# Altium schematic sheet 400_POWER_STAGE.SchDoc
size A2; SheetNumber: 4; SheetTotal: 5
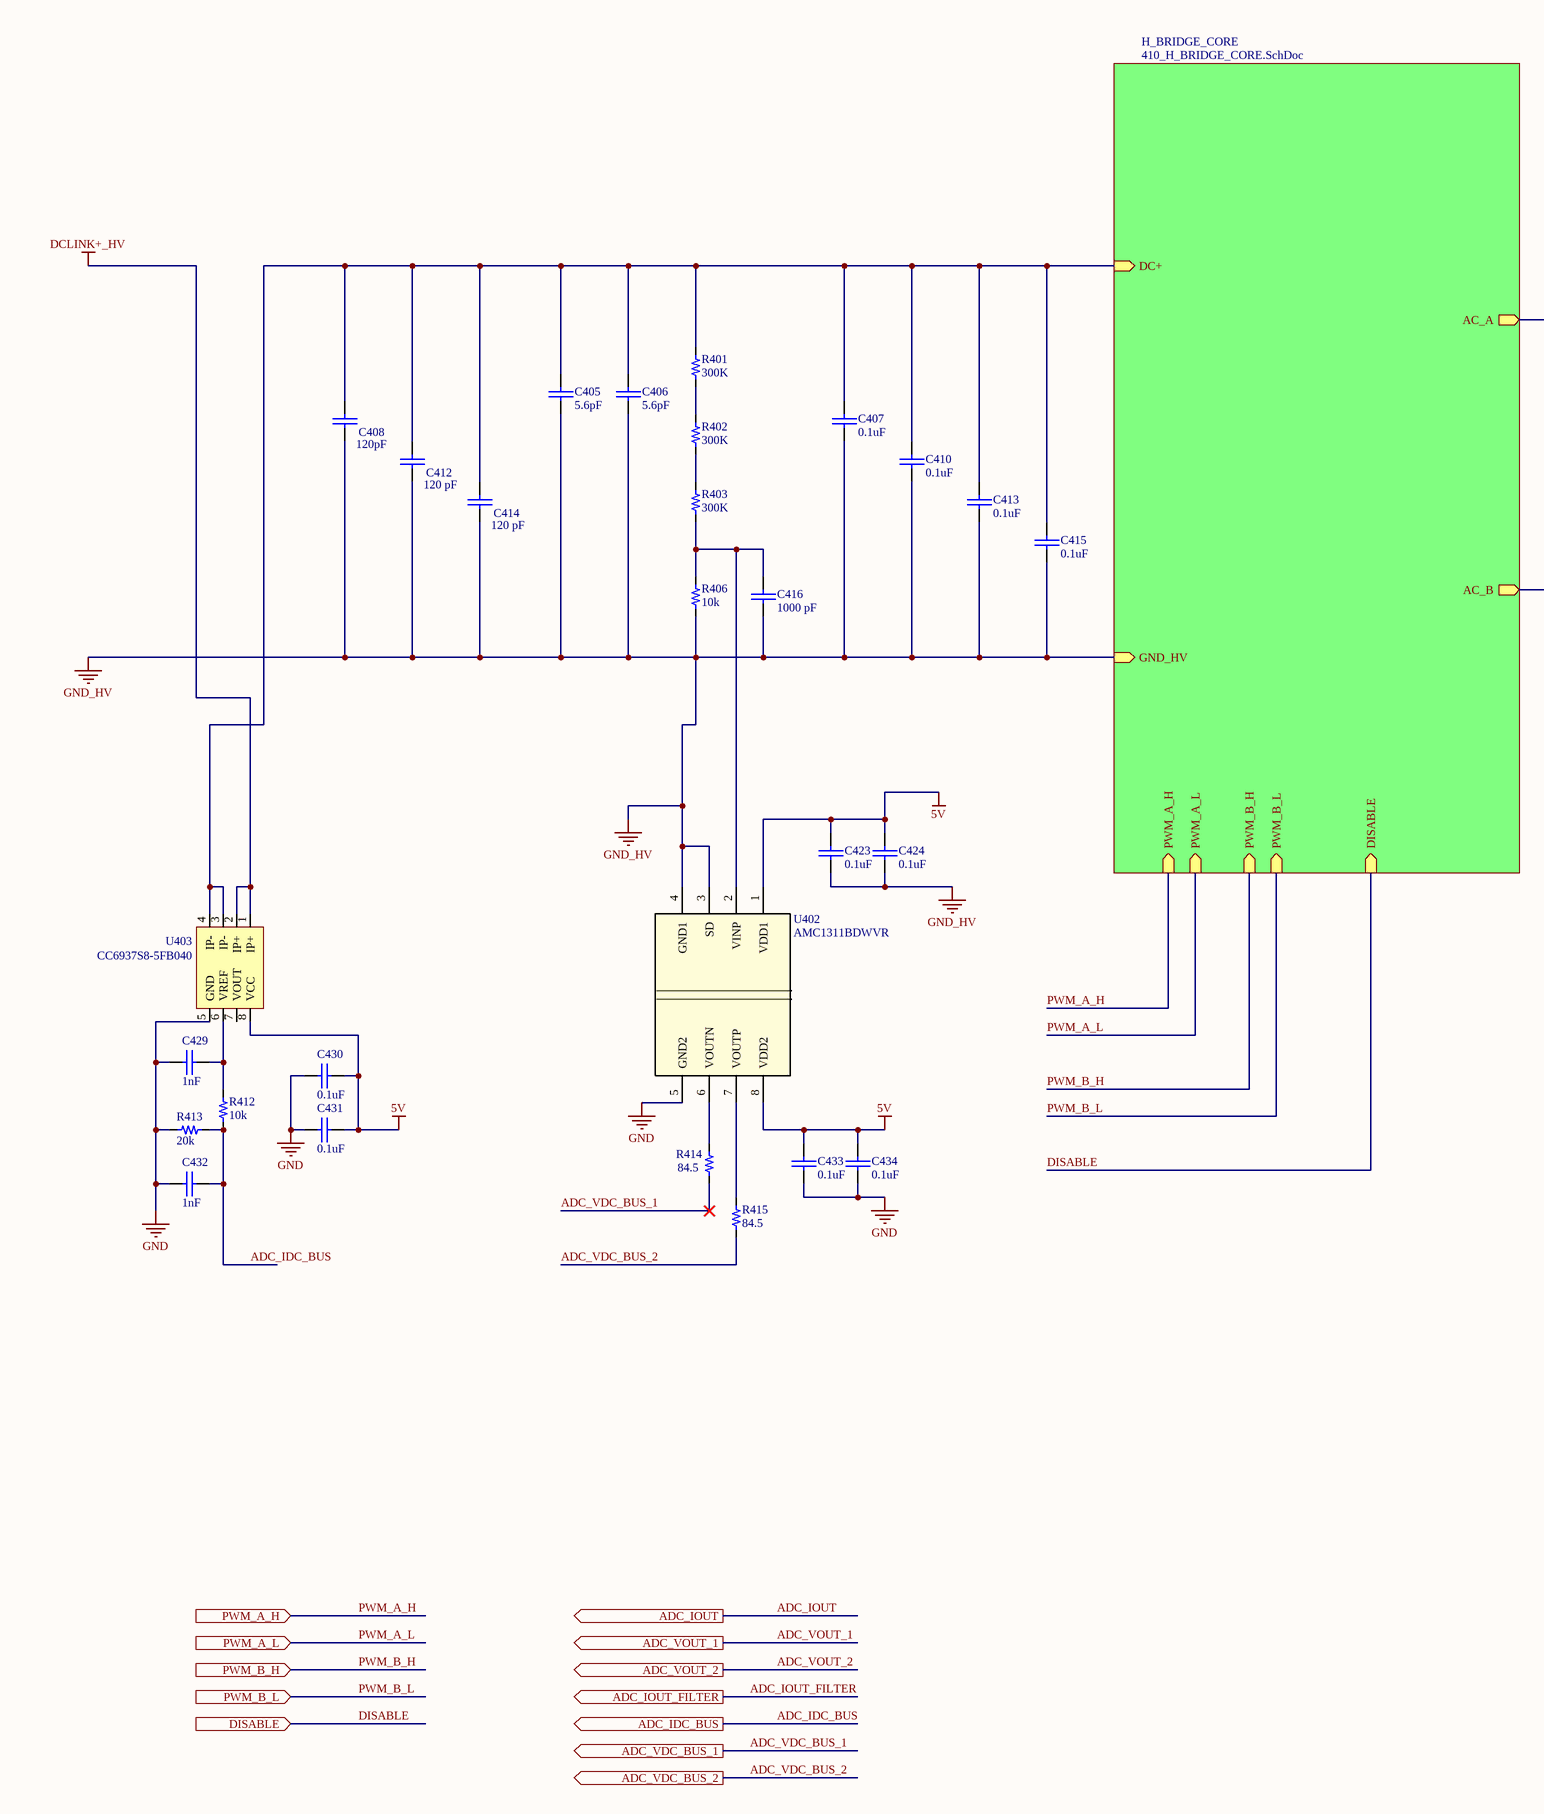
[diagram p0: 400_POWER_STAGE.SchDoc, left]
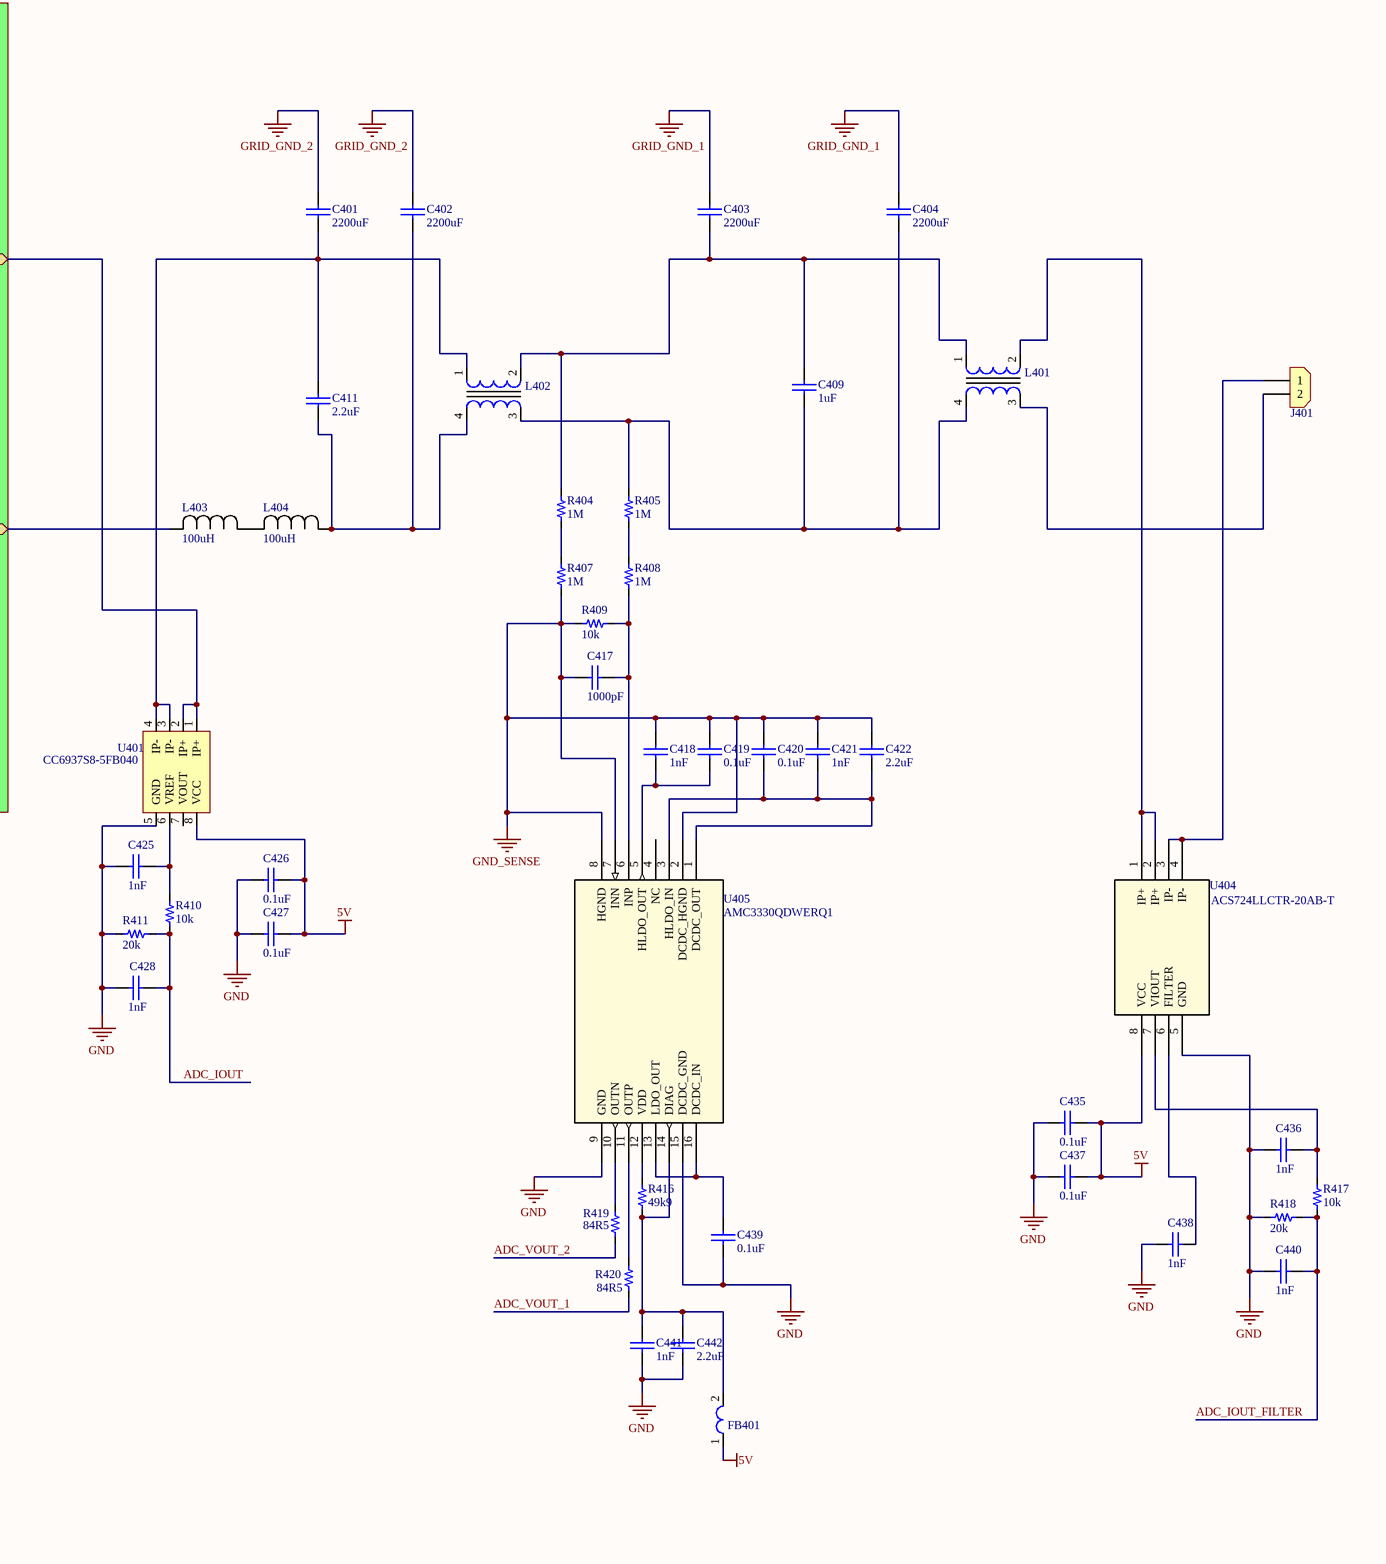
[diagram p1: 400_POWER_STAGE.SchDoc, right]

## Parts
C401  2200uF  [Through Hole,P=7.5mm]
C402  2200uF  [Through Hole,P=7.5mm]
C403  2200uF  [Through Hole,P=7.5mm]
C404  2200uF  [Through Hole,P=7.5mm]
C405  value 5.6pF  [0603_cap]  (hidden comment: 2.2uF)
C406  value 5.6pF  [0603_cap]  (hidden comment: 2.2uF)
C407  0.1uF  [0603_cap]
C408  120pF  [0603_cap]
C409  value 1uF  [CAP_2220]  (hidden comment: 1uF 50V)
C410  0.1uF  [0603_cap]
C411  value 2.2uF  [CAP_2220]
C412  120 pF  [0603_cap]
C413  0.1uF  [0603_cap]
C414  120 pF  [0603_cap]
C415  0.1uF  [0603_cap]
C416  1000 pF  [0603_cap]
C417  value 1000pF  [0603_cap]
C418  value 1nF  [0603_cap]
C419  0.1uF  [0603_cap]
C420  0.1uF  [0603_cap]
C421  value 1nF  [0603_cap]
C422  value 2.2uF  [0603_cap]
C423  0.1uF  [0603_cap]
C424  0.1uF  [0603_cap]
C425  value 1nF  [0603_cap]
C426  0.1uF  [0603_cap]
C427  0.1uF  [0603_cap]
C428  value 1nF  [0603_cap]
C429  value 1nF  [0603_cap]
C430  0.1uF  [0603_cap]
C431  0.1uF  [0603_cap]
C432  value 1nF  [0603_cap]
C433  0.1uF  [0603_cap]
C434  0.1uF  [0603_cap]
C435  0.1uF  [0603_cap]
C436  value 1nF  [0603_cap]
C437  0.1uF  [0603_cap]
C438  value 1nF  [0603_cap]
C439  0.1uF  [0603_cap]
C440  value 1nF  [0603_cap]
C441  value 1nF  [0603_cap]
C442  value 2.2uF  [0603_cap]
FB401  (no value)  [MH1608]
J401  (no value)  [CON_2x1_TH_5MM]
L401  (no value)  [PH9455405NL]
L402  (no value)  [PH9455405NL]
L403  value 100uH  [IND-SMD_L13.7-W12.8_FCH1365]  (hidden comment: 200uH)
L404  value 100uH  [IND-SMD_L13.7-W12.8_FCH1365]  (hidden comment: 200uH)
R401  300K  [0603_res]
R402  300K  [0603_res]
R403  300K  [0603_res]
R404  value 1M  [0603_res]
R405  value 1M  [0603_res]
R406  value 10k  [0603_res]
R407  value 1M  [0603_res]
R408  value 1M  [0603_res]
R409  value 10k  [0603_res]
R410  value 10k  [0603_res]
R411  20k  [0603_res]
R412  value 10k  [0603_res]
R413  20k  [0603_res]
R414  value 84.5  [0603_res]
R415  value 84.5  [0603_res]
R416  value 49k9  [0603_res]
R417  value 10k  [0603_res]
R418  20k  [0603_res]
R419  value 84R5  [0603_res]
R420  value 84R5  [0603_res]
U401  Manufacturer Part Number: CC6937S8-5FB040  [SOP-8_L4.9]
U402  AMC1311BDWVR  [DWV0008A]
U403  Manufacturer Part Number: CC6937S8-5FB040  [SOP-8_L4.9]
U404  Manufacturer Part Number: ACS724LLCTR-20AB-T  [SOICN8_LC_ALM]
U405  AMC3330QDWERQ1  [SOIC16_DWE_TEX]

## Sub-sheets
H_BRIDGE_CORE = 410_H_BRIDGE_CORE.SchDoc: PWM_A_H (in), PWM_A_L (in), PWM_B_H (in), PWM_B_L (in), DC+ (in), GND_HV (in), DISABLE (in), AC_A (out), AC_B (out)

## Ports
ADC_IDC_BUS (out), ADC_IOUT (out), ADC_IOUT_FILTER (out), ADC_VDC_BUS_1 (out), ADC_VDC_BUS_2 (out), ADC_VOUT_1 (out), ADC_VOUT_2 (out), DISABLE (in), PWM_A_H (in), PWM_A_L (in), PWM_B_H (in), PWM_B_L (in)

## Nets
5V: C423.1 C424.1 C426.2 C427.2 C430.2 C431.2 C433.1 C434.1 C435.2 C437.2 FB401.1 U401.8(VCC) U402.1(VDD1) U402.8(VDD2) U403.8(VCC) U404.8(VCC)
DCLINK+_HV: U403.1(IP+) U403.2(IP+)
GND: C425.2 C426.1 C427.1 C428.1 C429.2 C430.1 C431.1 C432.1 C433.2 C434.2 C435.1 C436.2 C437.1 C438.2 C439.2 C440.1 C441.2 C442.2 R411.1 R413.1 R418.1 U401.5(GND) U402.5(GND2) U403.5(GND) U404.5(GND) U405.9(GND) U405.15(DCDC_GND)
GND_HV: C405.2 C406.2 C407.2 C408.2 C410.2 C412.2 C413.2 C414.2 C415.2 C416.2 C423.2 C424.2 R406.1 U402.3(SD) U402.4(GND1) ; sheet H_BRIDGE_CORE/GND_HV
GND_SENSE: C417.1 C418.1 C419.1 C420.1 C421.1 C422.1 R407.1 R409.1 U405.2(DCDC_HGND) U405.7(INN) U405.8(HGND)
GRID_GND_1: C403.1 C404.1
GRID_GND_2: C401.1 C402.1
ADC_IDC_BUS: C432.2 R412.1 R413.2 ; port ADC_IDC_BUS
ADC_IOUT: C428.2 R410.1 R411.2 ; port ADC_IOUT
ADC_IOUT_FILTER: C440.2 R417.1 R418.2 ; port ADC_IOUT_FILTER
ADC_VDC_BUS_1: R414.1 ; port ADC_VDC_BUS_1
ADC_VDC_BUS_2: R415.1 ; port ADC_VDC_BUS_2
ADC_VOUT_1: R420.1 ; port ADC_VOUT_1
ADC_VOUT_2: R419.1 ; port ADC_VOUT_2
DISABLE: port DISABLE, sheet H_BRIDGE_CORE/DISABLE
PWM_A_H: port PWM_A_H, sheet H_BRIDGE_CORE/PWM_A_H
PWM_A_L: port PWM_A_L, sheet H_BRIDGE_CORE/PWM_A_L
PWM_B_H: port PWM_B_H, sheet H_BRIDGE_CORE/PWM_B_H
PWM_B_L: port PWM_B_L, sheet H_BRIDGE_CORE/PWM_B_L
NetC401_2: C401.2 C411.2 L402.1 U401.3(IP-) U401.4(IP-)
NetC402_2: C402.2 C411.1 L402.4 L404.1
NetC403_2: C403.2 C409.1 L401.1 L402.2 R404.2
NetC404_2: C404.2 C409.2 L401.4 L402.3 R405.2
NetC405_1: C405.1 C406.1 C407.1 C408.1 C410.1 C412.1 C413.1 C414.1 C415.1 R401.2 U403.3(IP-) U403.4(IP-) ; sheet H_BRIDGE_CORE/DC+
NetC416_1: C416.1 R403.1 R406.2 U402.2(VINP)
NetC417_2: C417.2 R408.1 R409.2 U405.6(INP)
NetC418_2: C418.2 C419.2 U405.5(HLDO_OUT)
NetC420_2: C420.2 C421.2 C422.2 U405.1(DCDC_OUT) U405.3(HLDO_IN)
NetC425_1: C425.1 R410.2 U401.6(VREF)
NetC429_1: C429.1 R412.2 U403.6(VREF)
NetC436_1: C436.1 R417.2 U404.7(VIOUT)
NetC438_1: C438.1 U404.6(FILTER)
NetC439_1: C439.1 U405.13(LDO_OUT) U405.16(DCDC_IN)
NetC441_1: C441.1 C442.1 FB401.2 R416.2 U405.14(DIAG)
NetJ401_1: J401.1 U404.3(IP-) U404.4(IP-)
NetJ401_2: J401.2 L401.3
NetL401_2: L401.2 U404.1(IP+) U404.2(IP+)
NetL403_1: L403.1 L404.2
NetL403_2: L403.2 ; sheet H_BRIDGE_CORE/AC_B
NetR401_1: R401.1 R402.2
NetR402_1: R402.1 R403.2
NetR404_1: R404.1 R407.2
NetR405_1: R405.1 R408.2
NetR414_2: R414.2 U402.6(VOUTN)
NetR415_2: R415.2 U402.7(VOUTP)
NetR416_1: R416.1 U405.12(VDD)
NetR419_2: R419.2 U405.10(OUTN)
NetR420_2: R420.2 U405.11(OUTP)
NetU401_1: U401.1(IP+) U401.2(IP+) ; sheet H_BRIDGE_CORE/AC_A

Not connected (* = marked no-connect by the designer): U401 7(VOUT); U403 7(VOUT); U405 4(NC)

## Library data of the parts
C401-C404 = CAP_CER_2200PF_300VAC: 2200 pF ±20% 300VAC Ceramic Capacitor E Radial, Disc; Manufacturer: Murata Electronics; Manufacturer Part Number: DE6E3KJ222MN3A; Supplier 1: LCSC; Supplier Part Number 1: C710554; ComponentLink1Description: LCSC; ComponentLink1URL: https://www.lcsc.com/product-detail/C710554.html?s_z=n_q_DE6E3KJ222MN3A&spm=wm.fly.bg.0.xh&lcsc_vid=FQVeX1BfQFIKVFVWE1NbBlcHQlcKVgFUQwMPAQZWElcxVlNRTlheV1JTQ1JYVzsOAxUeFF5JWBYZEEoKFBINSQcJGk4eFQsCAgIaSgADAwAHC0slRVBYUFVUTk8GEwkK; Value: 2200uF
C405 C406 = CAP_CER_5.6pF_C0G_250V_0603: 5.6pF C0G 250V 0603 Ceramic Capacitors RoHS; Manufacturer: Taiyo Yuden; Manufacturer Part Number: VJ0603D5R6CXPAJ; Supplier 1: LCSC; Supplier Part Number 1: C2241545; ComponentLink1Description: LCSC; ComponentLink1URL: https://www.lcsc.com/product-detail/C337443.html?s_z=n_q_EMK107BB7225KA-T&spm=wm.fly.bg.0.xh&lcsc_vid=FQVeX1BfQFIKVFVWE1NbBlcHQlcKVgFUQwMPAQZWElcxVlNRTlheVFNUQFFcXzsOAxUeFF5JWBYZEEoKFBINSQcJGk4eFQsCAgIaSgADAwAHC0slRldcVVFRWQkaCgg%3D
C407 C410 C413 C415 C419 C420 C423 C424 C426 C427 C430 C431 C433-C435 C437 C439 = Cap_0.1uF_0603_50V: CAP CER 100nF 50V Y5V 0603; Manufacturer: FOJAN; Manufacturer Part Number: FCC0603F104Z500CT; Supplier 1: LCSC; Supplier Part Number 1: C5137469; ComponentLink1Description: LCSC; ComponentLink1URL: https://www.lcsc.com/product-detail/C5137469.html?s_z=n_q_0603F104Z500CT&spm=wm.fly.bg.2.xh&lcsc_vid=Q1QLUFRRTgRfUVdSQAVWUgVQT1JdUlwFE1MMV1EEQgAxVlNRTlhfUFBXRlRXUTsOAxUeFF5JWBYZEEoKFBINSQcJGk4eFQsCAgIaSgADAwAHC0slTldfUldfWQkaCgg%3D; Value: 0.1uF
C408 C412 C414 = CAP_CER _120PF_250V_0603: 120 pF ±5% 250V Capacitores cerámicos C0G, NP0 0603 (1608 métrico); Manufacturer: YAGEO; Manufacturer Part Number: CL10B102KB8NNNC; Supplier 1: LCSC; Supplier Part Number 1: C3852667; ComponentLink1Description: LCSC; ComponentLink1URL: https://www.lcsc.com/product-detail/C3852667.html?s_z=n_q_CC0603JRNPOYBN121&spm=wm.fly.bg.0.xh&lcsc_vid=Q1QLUFRRTgRfUVdSQAVWUgVQT1JdUlwFE1MMV1EEQgAxVlNRTldaUVdSRlBeXjsOAxUeFF5JWBYZEEoKFBINSQcJGk4dAgUUFAk%3D
C409 = CAP CER 1uF 450V X7T 2220: Manufacturer: muRata; Manufacturer Part Number: GC355XD7LP105KX17L; Supplier 1: LCSC; Supplier Part Number 1: C5119323; ComponentLink1Description: LCSC; ComponentLink1URL: https://www.lcsc.com/product-detail/C5119323.html?s_z=n_q_t_ceramic%2520capacitor&spm=wm.fly.bg.0.xh___wm.ssy.tc.0.tz&lcsc_vid=Q1QLUFRRTgRfUVdSQAVWUgVQT1JdUlwFE1MMV1EEQgAxVlNRTlhcUlRSQVJdUzsOAxUeFF5JWBYZEEoKFBINSQcJGk4dAgUUFAk%3D
C411 = Cap_2.2uF_2220: CAP CER 2.2uF 250V X7R 2220; Manufacturer: CCTC; Manufacturer Part Number: 2220B225K251CT; Supplier 1: LCSC; Supplier Part Number 1: C3845592; ComponentLink1Description: LCSC; ComponentLink1URL: https://www.lcsc.com/product-detail/Multilayer-Ceramic-Capacitors-MLCC-SMD-SMT_CCTC-TCC0603X5R106K100CT_C380314.html
C416 = CAP_CER_1000PF_10V_X7R_0603: 1000 pF ±10% 10V Ceramic Capacitor X7R 0603 (1608 Metric); Manufacturer: Johanson Technology Inc.; Manufacturer Part Number: C0603C102K5RACTU; Supplier 1: LCSC; Supplier Part Number 1: C2167129; ComponentLink1Description: LCSC; ComponentLink1URL: https://www.lcsc.com/product-detail/C2167129.html?s_z=n_q_p_C0603C102K8RACTU&spm=wm.ssy.bg.0.xh&lcsc_vid=FQVeX1BfQFIKVFVWE1NbBlcHQlcKVgFUQwMPAQZWElcxVlNRTllaV1NURlFaVzsOAxUeFF5JWBYZEEoKFBINSQcJGk4eFQsCAgIaSgADAwAHC0slRlBaUVJRWQkaCgg%3D
C417 = CAP CER 1000pF 100V C0G 0603: CAP CER 1nF 100V C0G 0603; Manufacturer: muRata; Manufacturer Part Number: GRM1885C2A102JA01D; Supplier 1: LCSC; Supplier Part Number 1: C162257; ComponentLink1Description: LCSC; ComponentLink1URL: https://www.lcsc.com/product-detail/C162257.html?s_z=n_q_GRM1885C2A102JA01D&spm=wm.fly.bg.0.xh&lcsc_vid=FQVeX1BfQFIKVFVWE1NbBlcHQlcKVgFUQwMPAQZWElcxVlNRTlheVFZSTlJfXjsOAxUeFF5JWBYZEEoKFBINSQcJGk4%3D
C418 C421 C425 C428 C429 C432 C436 C438 C440 C441 = Cap_1nF_0603_50V: 50V 1nF X7R ±10% 0603 Multilayer Ceramic Capacitors MLCC - SMD/SMT ROHS; Manufacturer: YAGEO; Manufacturer Part Number: CC0603KRX7R9BB102; Supplier 1: LCSC; Supplier Part Number 1: C100040; ComponentLink1Description: LCSC; ComponentLink1URL: https://www.lcsc.com/product-detail/Multilayer-Ceramic-Capacitors-MLCC-SMD-SMT_YAGEO-CC0603KRX7R9BB102_C100040.html
C422 C442 = CAP CER 2.2uF 16V X7R 0603: Manufacturer: Taiyo Yuden; Manufacturer Part Number: EMK107BB7225KA-T; Supplier 1: LCSC; Supplier Part Number 1: C337443; ComponentLink1Description: LCSC; ComponentLink1URL: https://www.lcsc.com/product-detail/C337443.html?s_z=n_q_EMK107BB7225KA-T&spm=wm.fly.bg.0.xh&lcsc_vid=FQVeX1BfQFIKVFVWE1NbBlcHQlcKVgFUQwMPAQZWElcxVlNRTlheVFNUQFFcXzsOAxUeFF5JWBYZEEoKFBINSQcJGk4eFQsCAgIaSgADAwAHC0slRldcVVFRWQkaCgg%3D
FB401 = FERRITE_BEAD_600_OHM: FERRITE BEAD 600 OHM 0603 4LN; Manufacturer: Bourns Inc.; Manufacturer Part Number: MH1608-601Y; ComponentLink1Description: DigiKEy; ComponentLink1URL: https://www.digikey.com/en/products/detail/bourns-inc/MH1608-601Y/2563317; Supplier 1: DigiKey; Supplier Part Number 1: MH1608-601YCT-ND
J401 = Con_2x1_TH_5mm: 2POS 5MM; Manufacturer: JILN; Manufacturer Part Number: JL126-50002G01; Supplier 1: LCSC; Supplier Part Number 1: C394556; ComponentLink1Description: Digi-Key; ComponentLink1URL: https://www.lcsc.com/product-detail/Screw-terminal_JILN-JL126-50002G01_C394556.html
L401 L402 = CMC 4.5MH 12A 2LN 4.4 KOHM TH: 4.5 mH @ 4 MHz 2 Line Common Mode Choke Through Hole 4.4 kOhms @ 4 MHz 12A DCR 8.5mOhm; Manufacturer: WurthPULSE Elektronik; Manufacturer Part Number: PH9455.405NL; ComponentLink1Description: JLCPCB; ComponentLink1URL: https://www.lcsc.com/product-detail/C5718402.html; Supplier 1: JLCPCB; Supplier Part Number 1: C5718402
L403 L404 = FIXED_IND_100UH_3A_1: 200 µH Unshielded Drum Core, Wirewound Inductor 3 A 80mOhm Max Radial, Horizontal Cylinder (Open); Manufacturer: FANGCHENG; Manufacturer Part Number: FCH1365-101M; Supplier 1: LCSC; Supplier Part Number 1: C20415559; ComponentLink1Description: LCSC; ComponentLink1URL: https://www.lcsc.com/product-detail/C20415559.html?s_z=n_q_C20415559&globalKeyword=C20415559
R401-R403 = RES_300K_OHM_0603: 300 kOhms ±1% 0.1W, 1/10W Chip Resistor 0603 (1608 Metric) Moisture Resistant Thick Film; Manufacturer: YAGEO; Manufacturer Part Number: RC0603FR-07300KL; ComponentLink1URL: https://www.lcsc.com/product-detail/C114667.html?s_z=n_q_RC0603FR-07300KL&spm=wm.fly.bg.0.cbh&lcsc_vid=FQVeX1BfQFIKVFVWE1NbBlcHQlcKVgFUQwMPAQZWElcxVlNRTlldX1NfRlVdUjsOAxUeFF5JWBYZEEoKFBINSQcJGk4eFQsCAgIaSgADAwAHC0slQFBWUldRWQkaCgg%3D; Supplier 1: LCSC; Supplier Part Number 1: C114667; ComponentLink1Description: LCSC
R404 R405 R407 R408 = RES_SMD_1M_OHM_0603: 1 MOhms ±1% 0.125W, 1/8W Chip Resistor 0603 (1608 Metric) Automotive AEC-Q200 Thick Film; Manufacturer: Vishay Dale; Manufacturer Part Number: CRCW06031M00FKEA; ComponentLink1URL: https://www.lcsc.com/product-detail/C844922.html?s_z=n_q_CRCW06031M00FKEA&spm=wm.fly.bg.0.xh&lcsc_vid=FQVeX1BfQFIKVFVWE1NbBlcHQlcKVgFUQwMPAQZWElcxVlNRTlheVV1VQVNXVDsOAxUeFF5JWBYZEEoKFBINSQcJGk4dAgUUFAk%3D; Supplier 1: LCSC; Supplier Part Number 1: C844922; ComponentLink1Description: LCSC
R406 R409 R410 R412 R417 = Res_10k_0603_1/10W: RES SMD 10k OHM 5% 1/10W 0603; Manufacturer: FOJAN; Manufacturer Part Number: FRC0603J103TS; ComponentLink1URL: https://www.lcsc.com/product-detail/Chip-Resistor-Surface-Mount_FOJAN-FRC0603J103TS_C2930027.html; Supplier 1: LCSC; Supplier Part Number 1: C2930027; ComponentLink1Description: LCSC
R411 R413 R418 = RES_20K_OHM_0603: RES 20kΩ ±1% 100mW 0603; Manufacturer: FOJAN; Manufacturer Part Number: FRC0603F2002TS; ComponentLink1URL: https://www.lcsc.com/product-detail/C2907011.html?s_z=n_q_t_resistor%252020k&spm=wm.fly.bg.0.xh___wm.ssy.tc.0.tz&lcsc_vid=Q1QLUFRRTgRfUVdSQAVWUgVQT1JdUlwFE1MMV1EEQgAxVlNRTlhfXldRRFJaUDsOAxUeFF5JWBYZEEoKFBINSQcJGk4dAgUUFAk%3D; Supplier 1: LCSC; Supplier Part Number 1: C2907011; ComponentLink1Description: LCSC; Value: 20k
R414 R415 R419 R420 = Res_84R5_0603_1/10W: 100mW Thick Film Resistor 50V ±100ppm/℃ ±1% 84.5Ω 0603 Chip Resistor - Surface Mount ROHS; Manufacturer: LIZ Elec; Manufacturer Part Number: CR0603FA84R5G; ComponentLink1URL: https://lcsc.com/product-detail/Chip-Resistor-Surface-Mount_LIZ-Elec-CR0603FA84R5G_C101216.html; Supplier 1: LCSC; Supplier Part Number 1: C101216; ComponentLink1Description: LCSC
R416 = Res_49k9_0603_1/10W: 100mW Thick Film Resistor 75V ±100ppm/℃ ±1% 49.9kΩ 0603 Chip Resistor - Surface Mount ROHS; Manufacturer: YAGEO; Manufacturer Part Number: RC0603FR-0749K9L; ComponentLink1URL: https://lcsc.com/product-detail/Chip-Resistor-Surface-Mount_YAGEO-RC0603FR-0749K9L_C114624.html; Supplier 1: LCSC; Supplier Part Number 1: C114624; ComponentLink1Description: LCSC
U401 U403 = Cross chip CC6937S8-5FB040: High-performance Hall effect current sensor; Manufacturer: Cross chip; Supplier 1: LCSC; Supplier Part Number 1: C41421928; ComponentLink1Description: LCSC; ComponentLink1URL: https://www.lcsc.com/product-detail/C41421928.html?s_z=n_q_CC6937S8-5FB040&spm=wm.fly.bg.0.xh&lcsc_vid=Q1QLUFRRTgRfUVdSQAVWUgVQT1JdUlwFE1MMV1EEQgAxVlNRTldbV1ZWRVhcVTsOAxUeFF5JWBYZEEoKFBINSQcJGk4eFQsCAgIaSgADAwAHC0slRVlYVFZWTk8GEwkK
U402 = IC ISOLATION 8SOIC: Aislamiento CI 8-SOIC; Manufacturer: Texas Instruments; ComponentLink1Description: LCSC; ComponentLink1URL: https://www.lcsc.com/product-detail/C783598.html?s_z=n_q_AMC1311BDWVR&spm=wm.fly.bg.0.xh&lcsc_vid=Q1QLUFRRTgRfUVdSQAVWUgVQT1JdUlwFE1MMV1EEQgAxVlNRTlRXVFRQRFNYXjsOAxUeFF5JWBYZEEoKFBINSQcJGk4eFQsCAgIaSgADAwAHC0slRlNXXlBRWQkaCgg%3D; Supplier 1: LCSC; Manufacturer Part Number: AMC1311BDWVR; Supplier Part Number 1: C783598
U404 = CURRENT SENSOR 20A: Sensores de corriente ±20 A 1 canal Efecto Hall, Circuito abierto Bidireccional 8-SOIC (0.154", 3.90mm de ancho); Manufacturer: Allegro MicroSystems; ComponentLink1Description: LCSC; ComponentLink1URL: https://www.lcsc.com/product-detail/Current-Sensors_Allegro-MicroSystems-LLC-ACS724LLCTR-20AB-T_C99738.html; Supplier 1: LCSC; Supplier Part Number 1: C99738
U405 = IC ISOLATED AMPLIFIER: Precision, ±1V input, enhanced isolation amplifier with integrated DC/DC converter; Manufacturer: Texas Instruments; ComponentLink1Description: LCSC; ComponentLink1URL: https://www.lcsc.com/product-detail/C5214212.html?s_z=n_q_AMC3330QDWERQ1&spm=wm.fly.bg.0.xh&lcsc_vid=Q1QLUFRRTgRfUVdSQAVWUgVQT1JdUlwFE1MMV1EEQgAxVlNRTlRXU1ReRFBfUjsOAxUeFF5JWBYZEEoKFBINSQcJGk4dAgUUFAk%3D; Supplier 1: LCSC; Manufacturer Part Number: AMC3330QDWERQ1; Supplier Part Number 1: C5214212